# EAGLE design quahog-0.1.0 (EAGLE 7.6.0)
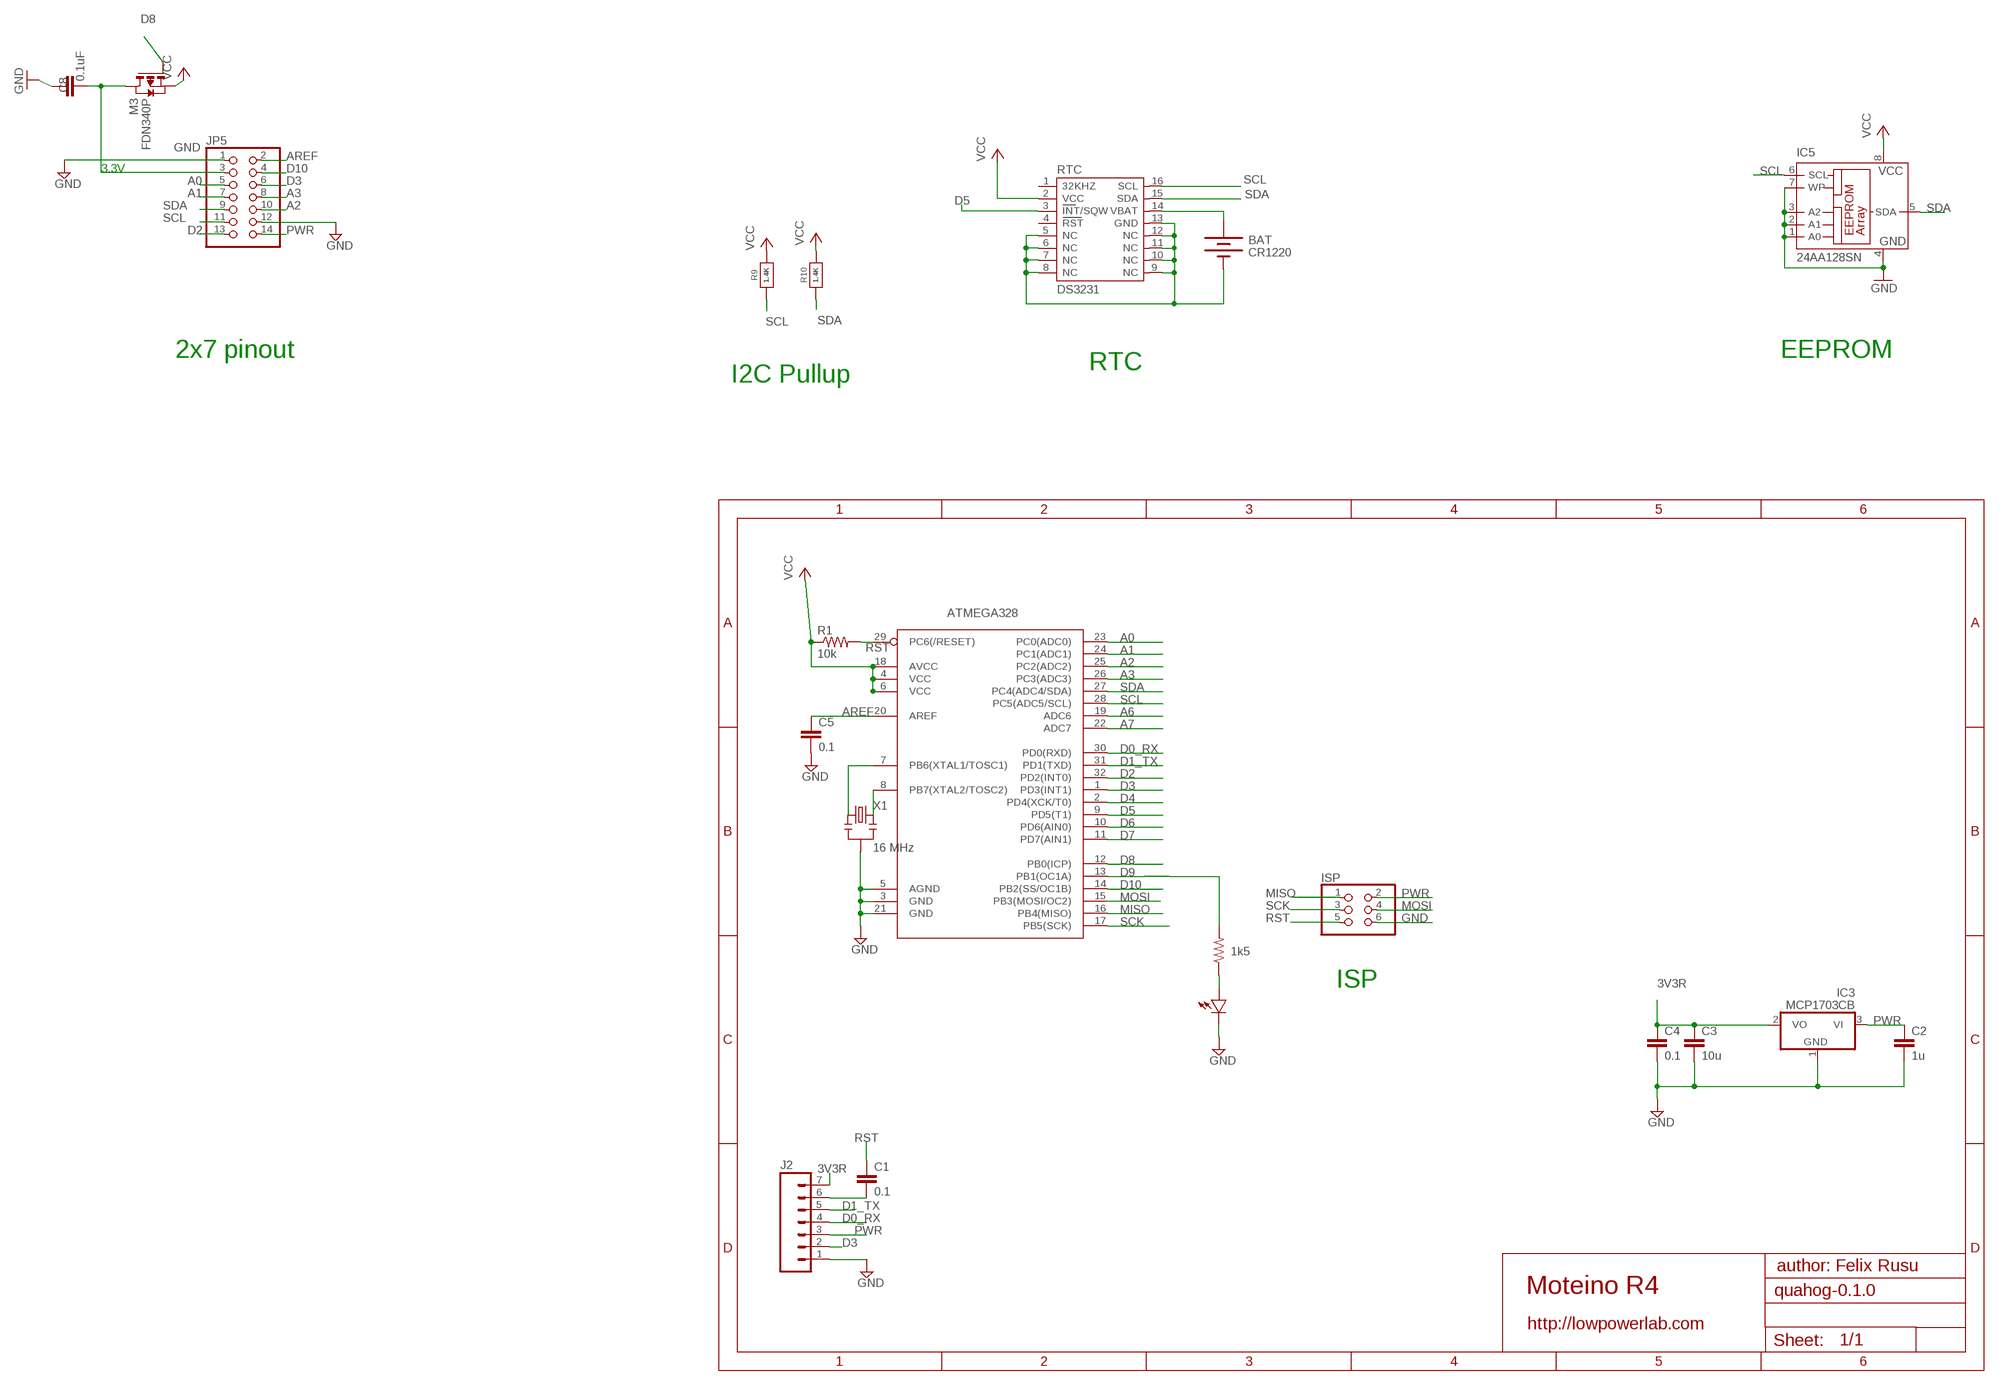
[diagram p0: schematic, sheet 1, part 1 of 2]
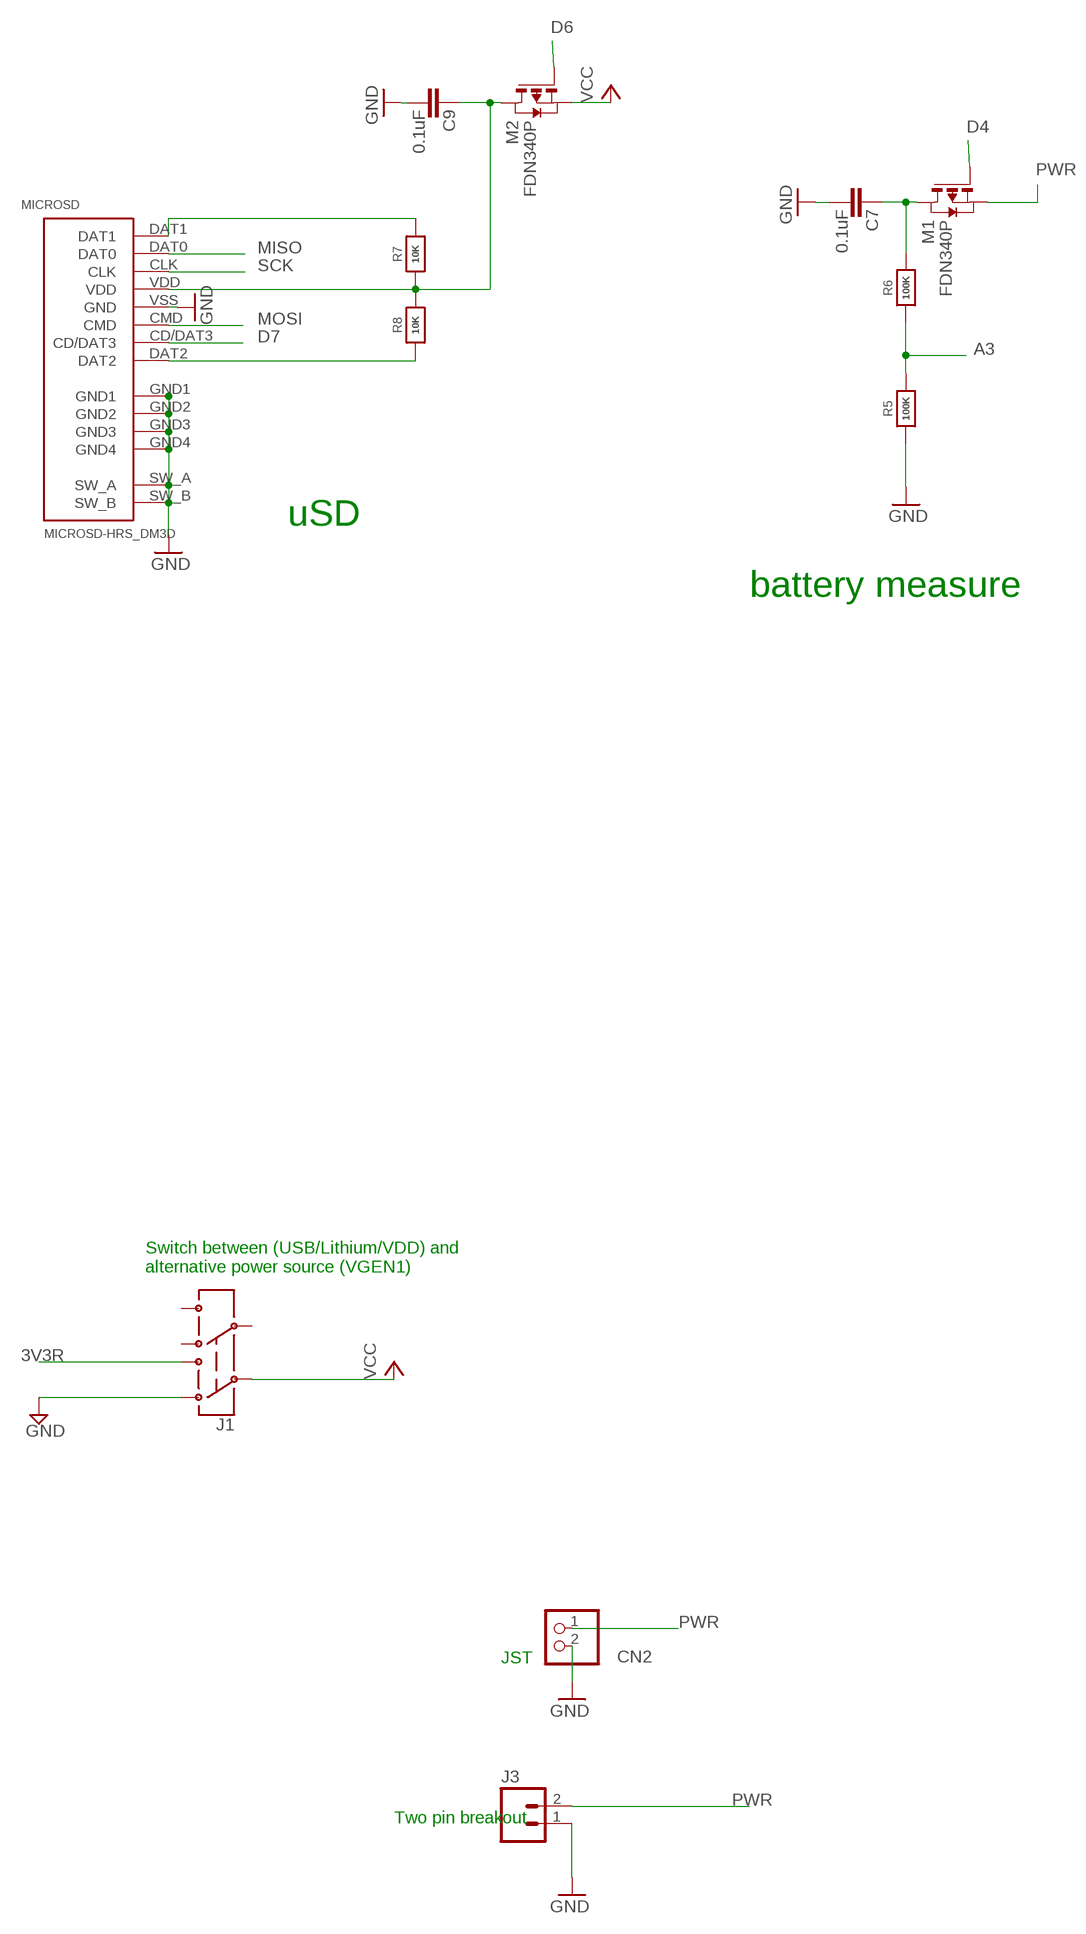
[diagram p1: schematic, sheet 1, part 2 of 2]

## Parts
ATMEGA328  ATMega-328  ATMEGA168/328TQFP32  [TQFP32-08]
BAT  CR1220  BATTERYBATTERY_12MM_SMT  [BATTCON_12MM_SMT]
C1  0.1  CAP0603-CAP  [0603-CAP]
C2  1u  CAP0603-CAP  [0603-CAP]
C3  10u  CAP0805-CAP  [0805-CAP]
C4  0.1  CAP0603-CAP  [0603-CAP]
C5  0.1  CAP0603-CAP  [0603-CAP]
C7  0.1uF  CAP0603-CAP  [0603-CAP]
C8  0.1uF  CAP0603-CAP  [0603-CAP]
C9  0.1uF  CAP0603-CAP  [0603-CAP]
CN2  JST_2PIN-SMT-RA  [JST-PH-2-SMT-RA]
D1  LED0603  [0603-LED]
IC3  MCP1703CB  [SOT23]
IC5  24AA128SN  [SO-08]
ISP  PINHD-2X3  [2X03]
J1  AYZ0202  [AYZ0202]
J2  M07  [1X07]
J3  M02PTH  [1X02]
JP5  PINHD-2X7  [2X07]
M1  FDN340P  PMOSSOT23  [SOT-23]
M2  FDN340P  PMOSSOT23  [SOT-23]
M3  FDN340P  PMOSSOT23  [SOT-23]
MICROSD  MICROSD-HRS_DM3D  [DM3D]
R1  10k  RESISTOR0603-RES  [0603-RES]
R2  1k5  RESISTOR0603-RES  [0603-RES]
R5  100K  RESISTOR_0603_NOOUT  [0603-NO]
R6  100K  RESISTOR_0603_NOOUT  [0603-NO]
R7  10K  RESISTOR_0603_NOOUT  [0603-NO]
R8  10K  RESISTOR_0603_NOOUT  [0603-NO]
R9  1.4K  RESISTOR_0603_NOOUT  [0603-NO]
R10  1.4K  RESISTOR_0603_NOOUT  [0603-NO]
RTC  DS3231  [DS3231]
X1  16 MHz  RESONATORSMD  [RESONATOR-SMD]

## Nets
3V3R: C3.1 C4.1 IC3.2(VO) J1.1 J2.7
A0: ATMEGA328.23(PC0(ADC0)) JP5.5
A1: ATMEGA328.24(PC1(ADC1)) JP5.7
A2: ATMEGA328.25(PC2(ADC2)) JP5.10
A3: ATMEGA328.26(PC3(ADC3)) JP5.8 R5.2 R6.1
A6: ATMEGA328.19(ADC6)
A7: ATMEGA328.22(ADC7)
AREF: ATMEGA328.20(AREF) C5.1 JP5.2
D0_RX: ATMEGA328.30(PD0(RXD)) J2.4
D1_TX: ATMEGA328.31(PD1(TXD)) J2.5
D2: ATMEGA328.32(PD2(INT0)) JP5.13
D3: ATMEGA328.1(PD3(INT1)) J2.2 JP5.6
D4: ATMEGA328.2(PD4(XCK/T0)) M1.3(G)
D5: ATMEGA328.9(PD5(T1)) RTC.3(INT/SQW)
D6: ATMEGA328.10(PD6(AIN0)) M2.3(G)
D7: ATMEGA328.11(PD7(AIN1)) MICROSD.CD/DAT3
D8: ATMEGA328.12(PB0(ICP)) M3.3(G)
D9: ATMEGA328.13(PB1(OC1A)) R2.2
D10: ATMEGA328.14(PB2(SS/OC1B)) JP5.4
GND [power]: ATMEGA328.3(GND) ATMEGA328.5(AGND) ATMEGA328.21(GND) BAT.P$1(-) C2.2 C3.2 C4.2 C5.2 C7.1 C8.2 C9.1 CN2.2 D1.MINUS IC3.1(GND) IC5.1(A0) IC5.2(A1) IC5.3(A2) IC5.4(GND) IC5.7(WP) ISP.6 J1.3 J2.1 J3.1 JP5.1 JP5.12 MICROSD.GND1 MICROSD.GND2 MICROSD.GND3 MICROSD.GND4 MICROSD.SW_A MICROSD.SW_B MICROSD.VSS(GND) R5.1 RTC.5(NC) RTC.6(NC) RTC.7(NC) RTC.8(NC) RTC.9(NC) RTC.10(NC) RTC.11(NC) RTC.12(NC) RTC.13(GND) X1.2
MISO: ATMEGA328.16(PB4(MISO)) ISP.1 MICROSD.DAT0
MOSI: ATMEGA328.15(PB3(MOSI/OC2)) ISP.4 MICROSD.CMD
N$1: ATMEGA328.7(PB6(XTAL1/TOSC1)) X1.1
N$2: D1.PLUS R2.1
N$4: C9.2 M2.1(D) MICROSD.VDD R7.1 R8.2
N$7: C8.1 JP5.3 M3.1(D)
N$15: C7.2 M1.1(D) R6.2
N$16: MICROSD.DAT1 R7.2
N$18: MICROSD.DAT2 R8.1
N$20: C1.2 J2.6
N$21: ATMEGA328.8(PB7(XTAL2/TOSC2)) X1.3
PWR [power]: C2.1 CN2.1 IC3.3(VI) ISP.2 J2.3 J3.2 JP5.14 M1.2(S)
RST: ATMEGA328.29(PC6(/RESET)) C1.1 ISP.5 R1.2
RTC_BATT: BAT.P$2(+) RTC.14(VBAT)
SCK: ATMEGA328.17(PB5(SCK)) ISP.3 MICROSD.CLK
SCL: ATMEGA328.28(PC5(ADC5/SCL)) IC5.6(SCL) JP5.11 R9.1 RTC.16(SCL)
SDA: ATMEGA328.27(PC4(ADC4/SDA)) IC5.5(SDA) JP5.9 R10.1 RTC.15(SDA)
VCC: ATMEGA328.4(VCC) ATMEGA328.6(VCC) ATMEGA328.18(AVCC) IC5.8(VCC) J1.2 M2.2(S) M3.2(S) R1.1 R9.2 R10.2 RTC.2(VCC)
Unconnected: J1.4 J1.5 J1.6 RTC.1(32KHZ) RTC.4(RST)

## Notes on the sheet
- 3.3V
- uSD
- 2x7 pinout | EEPROM
- RTC
- I2C Pullup
- battery measure
- Switch between (USB/Lithium/VDD) and 
  alternative power source (VGEN1)
- ISP
- JST
- Two pin breakout
- author: Felix Rusu
- Moteino R4
- http://lowpowerlab.com

## Library data of the parts
ATMEGA328 = LowPowerLab:ATMEGA168/328: Atmel 32-pin 8-bit micro, 16k flash.
BAT = SparkFunNew:BATTERY: Battery Holders Various common sizes : AA, AAA, 20mm coin cell and 12mm coin cell.
C1-C5 = LowPowerLab:CAP: Capacitor Standard 0603 ceramic capacitor, and 0.1" leaded capacitor.
C7-C9 = SparkFun:CAP: Capacitor Standard 0603 ceramic capacitor, and 0.1" leaded capacitor.
CN2 = adafruit:JST_2PIN: JST 2-Pin Connectors of various flavors SMT-RA (S2B-PH-SM4) 4UConnector #17311 SMT (B2B-PH-SM4) THM-RA (S2B-PH) THM (B2B-PH)
D1 = LowPowerLab:LED
IC3 = linear:MCP1703: 250 mA, 16V, Low Quiescent Current LDO Regulator Source: http://ww1.microchip.com/downloads/en/DeviceDoc/22049b.pdf
IC5 = microchip:24*: Serial EEPROM I2C; MF: MICROCHIP; MPN: 24AA128-I/SN; OC_FARNELL: unknown; OC_NEWARK: 92C6842
ISP = pinhead:PINHD-2X3: PIN HEADER
J1 = SparkFunNew:AYZ0202: SPDT Slide Switch Simple SMD single-pull double-throw slide switch. Good for less than 350mA power switch, switching UARTs between devices, etc. Spark Fun Electronics SKU : COM-00597
J2 = SparkFun-Connectors:M07: Header 7 Standard 7-pin 0.1" header. Use with straight break away headers (SKU : PRT-00116), right angle break away headers (PRT-00553), swiss pins (PRT-00743), machine pins (PRT-00117), and female headers (PRT-00115). NOTES ON THE VARIANTS LOCK and LOCK_LONGPADS... This footprint was designed to help hold the alignment of a through-hole component (i.e. 7-pin header) while soldering it into place. You may notice that each hole has been shifted either up or down by 0.005 of an inch from it's more standard position (which is usually a perfectly straight line). This slight alteration caused the pins (the squares in the middle) to touch the edges of the holes. Because they are alternating, it causes a "brace" to hold the header in place. 0.005 has proven to be the perfect amount of "off-center" position when using our standard breakaway headers. Although looks a little odd when you look at the bare footprint, once you have a header in there, the alteration is very hard to notice. Also, if you push a header all the way into place, it is covered up entirely on the bottom side. This idea of altering the position of holes to aid alignment will be further integrated into the Sparkfun Library for other footprints. It can help hold any component with 3 or more connection pins.
J3 = SparkFun-Connectors:M02: Standard 2-pin 0.1" header. Use with - straight break away headers ( PRT-00116) - right angle break away headers (PRT-00553) - swiss pins (PRT-00743) - machine pins (PRT-00117) - female headers (PRT-00115) Molex polarized connector foot print use with: PRT-08233 with associated crimp pins and housings. 2.54_SCREWTERM for use with PRT-10571. 3.5mm Screw Terminal footprints for PRT-08084 5mm Screw Terminal footprints for use with PRT-08432
JP5 = pinhead:PINHD-2X7: PIN HEADER
M1-M3 = zetex:PMOSSOT23: MOS FET; OC_FARNELL: unknown; OC_NEWARK: unknown
MICROSD = hrs_DM3D-SF:MICROSD-HRS_DM3D
R1 R2 = LowPowerLab:RESISTOR: Resistor Basic schematic elements and footprints for 0603, 1206, and PTH resistors.
R5-R10 = microbuilder:RESISTOR: Resistors For new designs, use the packages preceded by an '_' character since they are more reliable: The following footprints should be used on most boards: _0402 - Standard footprint for regular board layouts _0603 - Standard footprint for regular board layouts _0805 - Standard footprint for regular board layouts _1206 - Standard footprint for regular board layouts For extremely tight-pitch boards where space is at a premium, the following 'micro-pitch' footprints can be used (smaller pads, no silkscreen outline, etc.): _0402MP - Micro-pitch footprint for very dense/compact boards _0603MP - Micro-pitch footprint for very dense/compact boards _0805MP - Micro-pitch footprint for very dense/compact boards _1206MP - Micro-pitch footprint for very dense/compact boards
RTC = _lh-library:DS3231
X1 = SparkFun:RESONATOR: Resonator Small SMD resonator. This is the itty bitty 10/20MHz resonators with built in caps. CSTCE10M0G55 and CSTCE20M0V53. Footprint has been reviewed closely but hasn't been tested yet.

## Net classes
1 power: width 0.305 mm

## Board
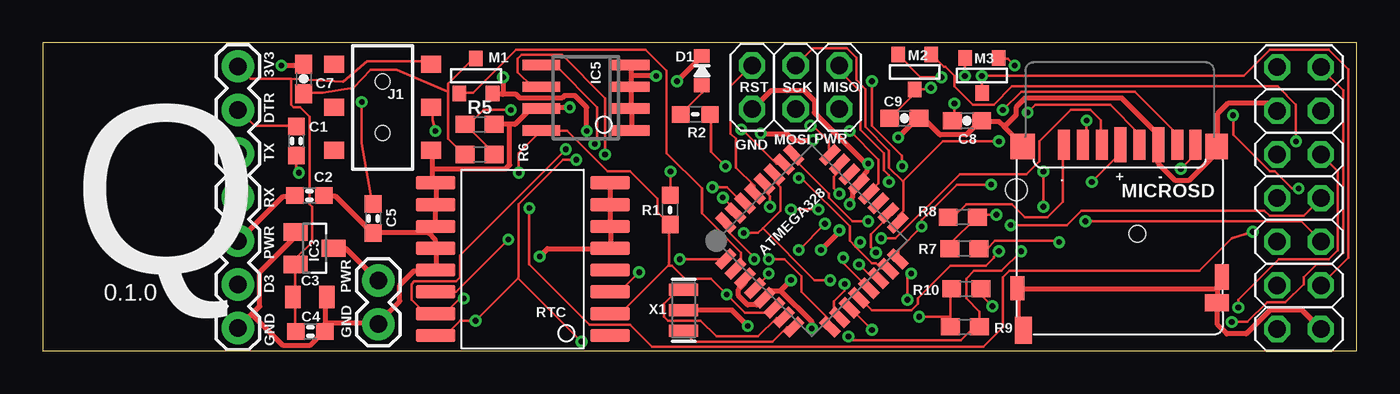
[diagram p2: board, top side]
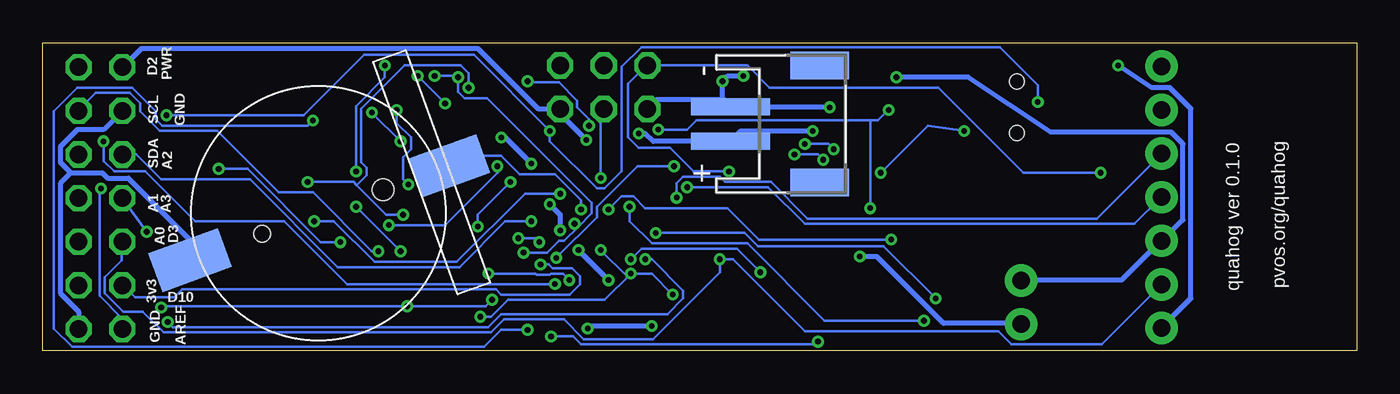
[diagram p3: board, bottom side, seen from below]

Size 76.5 x 17.92 mm. Coordinates in mm from the lower left corner, seen from the top.
Outline: 0,0 76.5,0 76.5,17.92 0,17.92 0,0
Copper layers (1*16): Top 0.0356mm / dielectric 1.5011mm / Bottom 0.0356mm
Design rules "oshpark-2layer *": minimum track width 6mil, minimum drill 13mil, track to track 6mil, track to pad 6mil, pad to pad 6mil, via to via 6mil, smd to smd 6mil, copper to edge 6mil, drill to drill 6mil, minimum pad ring 7mil, minimum via ring 7mil, stop-mask expansion 2.5mil, vias tented up to drill 0mil, thermal gap 10mil

### Footprints (pad centres in the part's own frame; a part is rotated, then mirrored left to right if it is on the bottom)
TQFP32-08 = smd 1.27 x 0.533: 1 -4.293,2.8; 2 -4.293,2; 3 -4.293,1.2; 4 -4.293,0.4; 5 -4.293,-0.4; 6 -4.293,-1.2; 7 -4.293,-2; 8 -4.293,-2.8; 17 4.293,-2.8; 18 4.293,-2; 19 4.293,-1.2; 20 4.293,-0.4; 21 4.293,0.4; 22 4.293,1.2; 23 4.293,2; 24 4.293,2.8 | smd 0.533 x 1.27: 9 -2.8,-4.293; 10 -2,-4.293; 11 -1.2,-4.293; 12 -0.4,-4.293; 13 0.4,-4.293; 14 1.2,-4.293; 15 2,-4.293; 16 2.8,-4.293; 25 2.8,4.293; 26 2,4.293; 27 1.2,4.293; 28 0.4,4.293; 29 -0.4,4.293; 30 -1.2,4.293; 31 -2,4.293; 32 -2.8,4.293
BATTCON_12MM_SMT = smd 2.4 x 4.3: P$1 0,11.96 | smd 2.4 x 4.2: P$2 0,-4.1 | hole 0.95: 0,7.5 | hole 1.25: 0,0
0603-CAP = smd 1.016 x 0.965: 1 -0.85,0; 2 0.85,0
0805-CAP = smd 0.902 x 1.3: 1 -1,0; 2 1,0
0603-CAP' = smd 1.1 x 1: 1 -0.85,0; 2 0.85,0
JST-PH-2-SMT-RA = smd 1 x 4.6: 1 1,-3.7; 2 -1,-3.7 | smd 1.6 x 3.4: NC1 -3.4,1.5; NC2 3.4,1.5
0603-LED = smd 0.8 x 0.9: MINUS -0.85,0; PLUS 0.85,0
SOT23 = smd 1 x 1.4: 1 -0.95,-1.1; 2 0.95,-1.1; 3 0,1.1
SO-08 = smd 0.6 x 2.2: 1 -1.905,-2.6; 2 -0.635,-2.6; 3 0.635,-2.6; 4 1.905,-2.6; 5 1.905,2.6; 6 0.635,2.6; 7 -0.635,2.6; 8 -1.905,2.6
2X03 = drill 1.016 octagon: 1 -2.54,-1.27; 2 -2.54,1.27; 3 0,-1.27; 4 0,1.27; 5 2.54,-1.27; 6 2.54,1.27
AYZ0202 = smd 1 x 1.15: 1 -2.5,2.825; 2 0,2.825; 3 2.5,2.825; 4 -2.5,-2.825; 5 0,-2.825; 6 2.5,-2.825 | hole 0.85: 1.5,0; -1.5,0
1X07 = drill 1.016 pad 1.88: 1 0,0; 2 2.54,0; 3 5.08,0; 4 7.62,0; 5 10.16,0; 6 12.7,0; 7 15.24,0
1X02 = drill 1.016 pad 1.88: 1 0,0; 2 2.54,0
2X07 = drill 1.016 octagon: 1 -7.62,-1.27; 2 -7.62,1.27; 3 -5.08,-1.27; 4 -5.08,1.27; 5 -2.54,-1.27; 6 -2.54,1.27; 7 0,-1.27; 8 0,1.27; 9 2.54,-1.27; 10 2.54,1.27; 11 5.08,-1.27; 12 5.08,1.27; 13 7.62,-1.27; 14 7.62,1.27
SOT-23 = smd 0.787 x 0.889: 1 0.025,-1.016; 2 -0.94,1.016; 3 0.991,1.016
DM3D = smd 0.7 x 1.75: CD/DAT3 8.15,0.45; CLK 4.85,0.45; CMD 7.05,0.45; DAT0 2.65,0.45; DAT1 1.6,0.45; DAT2 9.25,0.45 | smd 0.8 x 1.5: GND1 0.05,8.15 | smd 0.8 x 1.4: GND2 11.95,8.8 | smd 1.4 x 1.5: GND3 11.65,0.55 | smd 1.3 x 1.5: GND4 0.35,0.55 | smd 1 x 1.55: SW_A 11.6,11.25 | smd 1.4 x 1: SW_B 0.35,9.65 | smd 0.7 x 2.032: VDD 5.95,0.45; VSS 3.75,0.45
0603-RES = smd 1.016 x 0.965: 1 -0.85,0; 2 0.85,0
0603-NO = smd 1.1 x 1: 1 -0.85,0; 2 0.85,0
DS3231 = smd 0.762 x 2.286: 1 -4.445,-5.08; 2 -3.175,-5.08; 3 -1.905,-5.08; 4 -0.635,-5.08; 5 0.635,-5.08; 6 1.905,-5.08; 7 3.175,-5.08; 8 4.445,-5.08; 9 4.445,5.08; 10 3.175,5.08; 11 1.905,5.08; 12 0.635,5.08; 13 -0.635,5.08; 14 -1.905,5.08; 15 -3.175,5.08; 16 -4.445,5.08
RESONATOR-SMD = smd 0.7 x 1.7: 1 -1.2,0; 2 0,0; 3 1.2,0

### Placement (x,y rotation side)
ATMEGA328  44.78,6.4 45 top
BAT  56.69,9.37 110 bottom
C1  14.76,12.22 90 top
C2  15.52,9.04 0 top
C3  15.54,3.12 0 top
C4  15.57,1.12 0 top
C5  19.23,7.7 270 top
C7  0.1uF  [0603-CAP']  15.19,15.82 270 top
C8  0.1uF  [0603-CAP']  53.82,13.39 0 top
C9  0.1uF  [0603-CAP']  50.17,13.54 180 top
CN2  32.77,13.21 270 bottom
D1  38.38,16.31 270 top
IC3  15.82,5.97 270 top
IC5  31.62,14.73 90 top
ISP  43.84,15.34 180 top
J1  19.79,14.17 270 top
J2  11.35,1.32 90 top
J3  19.53,1.55 90 top
JP5  73.15,8.89 90 top
M1  25.25,16 180 top
M2  50.75,16.23 0 top
M3  54.66,16.03 0 top
MICROSD  68.71,12.45 180 top
R1  36.53,8.2 90 top
R2  38,13.77 0 top
R5  25.43,13.18 180 top
R6  25.43,11.43 180 top
R7  53.67,5.94 0 top
R8  53.57,7.77 0 top
R9  53.7,1.4 180 top
R10  53.77,3.61 180 top
RTC  27.94,5.33 90 top
X1  37.31,2.36 270 top

### Tracks (layer width: path | path; a pad name or v marks a point on that pad's centre or on a via)
3V3R
  Top 0.152: C4.1 14.68,1.14 14.68,3.05 14.6,3.12 C3.1 14.68,3.12 14.68,4.95 IC3.2 14.76,5.03 14.76,5.41 15.67,6.33 15.67,8.38 15.52,8.53 15.52,13.64 14.99,14.17 14.6,14.17 14.45,14.33 14.45,15.85 | 14.45,15.85 12.09,15.85 11.4,16.54 J2.7 | 14.45,15.85 17.47,15.67 18.87,16.87 22.33,16.87 J1.1
A0  (via drill 0.33)
  Top 0.152: v46.38,9.14 46.08,9.45 46.08,10.13 46.38,10.44 46.38,10.82 ATMEGA328.23 | v60.71,7.54 73.28,7.54 74.42,6.4 JP5.5
  Bottom 0.152: v46.38,9.14 48.44,9.14 52.4,5.18 57.2,5.18 59.56,7.54 v60.71,7.54
A1  (via drill 0.33)
  Top 0.152: v44.7,13.11 44.86,13.11 45.77,12.19 45.77,11.43 ATMEGA328.24 | v48.29,15.7 48.29,13.11 50.04,11.35 v50.04,10.74 | v56.36,7.32 59.64,7.32 60.48,8.15 71.14,8.15 71.45,7.85 73.43,7.85 74.42,8.84 JP5.7
  Bottom 0.152: v44.7,13.11 44.7,13.49 45.39,14.17 45.39,14.55 46.46,15.62 48.21,15.62 v48.29,15.7 | v50.04,10.74 50.04,10.36 53.09,7.32 v56.36,7.32
A2  (via drill 0.33)
  Top 0.152: v48.06,7.54 47.14,7.54 45.77,8.91 45.77,9.14 43.79,11.12 43.79,11.35 ATMEGA328.25
  Bottom 0.152: v48.06,7.54 49.58,7.54 52.25,4.88 59.33,4.88 64.44,9.98 69.62,9.98 71.07,11.43 JP5.10
A3  (via drill 0.33)
  Top 0.152: R6.1 26.34,11.43 R5.2 24.74,13.11 25.65,14.02 v27.25,14.02 | v40.67,12.88 40.74,12.88 42.72,10.9 43.1,10.9 ATMEGA328.26 | v70.46,6.93 69.24,6.55 67.33,4.65 56.29,4.65 55.91,4.27 55.91,1.37 54.76,0.23 35.48,0.23 34.19,1.52 31.83,1.52 28.32,5.03 v28.32,8.31
  Bottom 0.152: v40.67,12.88 38.99,12.88 38.46,13.41 28.32,13.41 | 28.32,13.41 27.86,13.41 v27.25,14.02 | v70.46,6.93 JP5.8 | 28.32,13.41 v28.32,8.31
AREF  (via drill 0.33)
  Top 0.152: v18.57,14.48 18.57,12.09 19.18,8.61 C5.1 | v46.99,12.8 48.67,11.12 48.67,9.75 48.13,9.22 ATMEGA328.20 | v73.13,9.45 72.75,9.45 71.75,10.44 71.45,10.44 69.32,12.57 v69.32,13.72
  Bottom 0.152: v18.57,14.48 18.57,15.47 20.78,17.68 41.66,17.68 42.8,16.54 42.8,10.44 43.79,9.45 44.25,9.45 46.99,12.19 v46.99,12.8 51.41,17.22 57.81,17.22 61.32,13.72 v69.32,13.72 | v73.13,9.45 73.2,9.37 73.2,3.2 71.91,1.91 71.91,1.29 JP5.2
D0_RX  (via drill 0.33)
  Top 0.152: v38.99,9.53 39.83,9.53 40.74,8.61 40.89,8.61 ATMEGA328.30
  Bottom 0.152: v38.99,9.53 34.27,9.53 32.13,7.39 12.93,7.39 11.4,8.91 J2.4
D1_TX  (via drill 0.33)
  Top 0.152: v39.6,8.91 40.28,8.23 40.28,8.08 ATMEGA328.31
  Bottom 0.152: v39.6,8.91 39.6,9.75 39.22,10.13 37.08,10.13 36.78,9.83 34.11,9.83 31.98,7.7 15.14,7.7 J2.5
D2  (via drill 0.33)
  Top 0.152: v41.43,5.33 41.43,5.41 39.83,7.01 39.83,7.39 ATMEGA328.32 | v69.24,1.68 70.16,1.68 71.3,2.82 72.36,2.82 73.43,3.89 73.43,4.27 74.19,5.03 75.03,5.03 75.72,5.71 75.72,15.16 74.42,16.46 JP5.13
  Bottom 0.152: v41.43,5.33 41.05,5.33 39.22,3.5 39.22,3.05 40.13,2.13 49.81,2.13 50.57,1.37 68.94,1.37 v69.24,1.68
D3  (via drill 0.33)
  Top 0.152: v37.08,5.33 39.75,5.33 ATMEGA328.1
  Bottom 0.152: J2.2 14.83,0.38 20.09,0.38 20.85,1.14 32.13,1.14 36.32,5.33 v37.08,5.33 37.08,4.57 40.97,0.69 45.01,0.69 46.15,1.83 49.66,1.83 50.42,1.07 69.47,1.07 70.69,2.29 71.83,2.29 72.9,3.35 72.9,4.27 71.91,5.26 71.91,6.33 JP5.6
D4
  Top 0.152: M1.3 24.28,15.01 25.04,15.01 27.56,17.53 35.1,17.53 36.32,16.31 36.32,11.51 38.38,9.45 38.38,8 40.67,5.71 40.67,5.11 40.36,4.8 ATMEGA328.2
D5  (via drill 0.33)
  Top 0.152: v42.27,5.33 43.18,5.33 44.17,4.34 44.17,3.43 45.77,1.83 45.77,1.45 ATMEGA328.9 | v34.72,4.57 33.58,3.43 RTC.3
  Bottom 0.152: v42.27,5.33 41.66,5.94 36.09,5.94 v34.72,4.57
D6  (via drill 0.33)
  Top 0.152: v72.97,12.19 72.97,14.33 71.91,15.39 56.44,15.39 55.37,14.33 54.15,14.33 53.09,15.39 53.09,16 52.55,16.54 52.48,16.54 51.79,17.22 M2.3 | v46.69,3.89 46.69,3.5 46.08,2.9 46.08,2.29 46.38,1.98 ATMEGA328.10
  Bottom 0.152: v72.97,12.19 72.97,11.05 72.36,10.44 70.54,10.44 67.64,7.54 62.46,7.54 58.8,3.89 v46.69,3.89
D7  (via drill 0.33)
  Top 0.152: v48.29,1.22 46.99,2.52 ATMEGA328.11 | v60.78,13.41 60.78,12.19 60.63,12.04 MICROSD.CD/DAT3
  Bottom 0.152: v48.29,1.22 49.81,1.22 50.8,0.23 74.8,0.23 75.87,1.29 75.87,13.95 74.5,15.32 71.3,15.32 69.93,13.95 69.93,13.49 69.55,13.11 61.09,13.11 v60.78,13.41
D8  (via drill 0.33)
  Top 0.152: v56.59,16.61 56.21,16.99 55.68,16.99 M3.3 | v58.27,8.38 v58.27,10.44 | v55.68,5.79 55.37,5.49 55.37,5.41 54.92,4.95 52.86,4.95 50.95,3.05 50.95,2.74 50.57,2.36 48.29,2.36 47.6,3.05 ATMEGA328.12
  Bottom 0.152: v56.59,16.61 56.59,15.93 58.27,14.25 v58.27,10.44 | v55.68,5.79 v58.27,8.38
D9  (via drill 0.33)
  Top 0.152: v39.75,10.74 38.91,11.58 38.91,13.72 R2.2 | v46.61,5.41 46.61,5.11 48.06,3.66 ATMEGA328.13
  Bottom 0.152: v39.75,10.74 41.89,10.74 44.25,8.38 44.25,7.77 v46.61,5.41
D10  (via drill 0.33)
  Top 0.152: v47.52,5.03 48.29,4.27 48.59,4.27 ATMEGA328.14
  Bottom 0.152: v47.52,5.03 47.07,5.03 46.84,4.8 45.7,4.8 45.24,4.34 45.24,3.89 45.85,3.28 49.81,3.28 50.11,3.58 68.4,3.58 68.86,3.12 71.14,3.12 71.83,3.81 JP5.4
GND  (via drill 0.33)
  Top 0.305: MICROSD.SW_A 57.05,1.22 56.82,1.45 56.82,3.58 MICROSD.GND2 56.97,3.58 68.33,3.58 MICROSD.GND1 68.63,4.27 68.4,4.04 68.4,2.82 MICROSD.SW_B 68.4,2.67 68.4,1.52 68.94,0.99 70.08,0.99 71.45,2.36 73.35,2.36 74.42,1.29 JP5.1 | 55.98,13.03 57.05,11.96 MICROSD.GND3 | 55.98,13.03 55.68,13.34 54.69,13.34 C8.2 54.53,13.34 53.77,12.57 52.25,12.57 51.33,13.49 51.03,13.49 C9.1 50.88,13.49 v49.81,12.42 | JP5.12 71.45,14.4 69.01,14.4 68.4,13.79 68.4,11.96 MICROSD.GND4 68.33,11.73 68.33,11.51 66.73,9.91 65.96,9.91 64.97,10.9 64.97,11.96 MICROSD.VSS 64.9,12.12 64.9,12.65 62.84,14.71 57.2,14.71 56.67,14.17 56.67,13.72 55.98,13.03 | IC5.1 34.27,12.88 34.27,14.1 IC5.2 34.27,14.17 34.27,15.32 IC5.3 34.27,15.47 34.27,16 | 34.27,16 34.27,16.61 IC5.4 | v36.93,15.7 38.38,17.14 D1.MINUS | v35.71,16 34.27,16 | ATMEGA328.3 40.89,4.19 40.89,3.96 40.51,3.58 40.51,3.2 41.05,2.67 41.58,2.67 41.96,3.05 ATMEGA328.5 42.11,3.2 42.42,3.5 42.95,3.5 | X1.2 40.13,2.36 v41.05,1.45 | v44.78,1.29 44.78,1.68 42.95,3.5 | 47.98,10.82 47.98,10.44 47.6,10.06 47.6,9.75 ATMEGA328.21 47.45,9.6 47.14,9.3 47.14,8.91 46.99,8.76 v46.99,8.53 | 47.98,10.82 44.93,13.87 44.93,14.55 44.32,15.16 42.42,15.16 41.35,14.1 ISP.6 | v43.56,4.12 42.95,3.5 | v45.31,5.87 46.38,6.93 v46.38,7.01 | 22.45,6.86 19.25,6.86 C5.2 19.1,6.93 17.04,8.99 16.43,8.99 C2.2 | 22.45,6.86 22.84,7.24 RTC.11 22.84,7.32 22.84,8.38 RTC.10 22.91,8.53 22.91,9.68 RTC.9 22.84,9.83 22.68,9.98 22.68,10.59 | 22.45,6.86 22.84,6.48 22.84,6.1 RTC.12 22.91,5.94 22.91,4.72 RTC.13 22.76,4.65 21.61,4.65 20.78,3.81 20.78,2.9 19.56,1.68 J3.1 19.48,1.6 16.43,1.6
  Top 0.305: 27.18,13.18 27.48,13.18 28.4,14.1 IC5.7 29.16,14.17 v30.68,14.17 | 27.18,13.18 R5.1 | 22.68,10.59 22.68,11.73 J1.3 | 27.18,13.18 27.18,10.82 26.95,10.59 22.68,10.59 | v13.89,16.61 15.14,16.61 C7.1 | J2.1 12.17,2.13 | 12.17,2.13 12.62,2.59 12.62,4.57 14.68,6.63 14.68,6.86 IC3.1 | RTC.8 33.05,9.75 33.05,8.61 RTC.7 33.05,8.46 33.05,7.32 RTC.6 33.05,7.24 33.05,6.02 RTC.5 32.89,5.94 29.39,5.94 v28.93,5.49 | 16.43,1.6 16.43,3.05 16.51,3.12 C3.2 | 16.43,1.6 16.43,1.14 C4.2 16.28,1.07 15.52,0.3 13.99,0.3 12.17,2.13 | v48.06,10.9 47.98,10.82
  Bottom 0.305: 74.88,10.36 73.05,10.36 72.75,10.06 71.53,10.06 67.94,6.48 67.94,5.33 BAT.P$1 | 74.88,10.36 75.49,10.97 75.49,11.89 74.5,12.88 72.97,12.88 JP5.12 | JP5.1 74.42,2.29 75.49,3.35 75.49,9.75 74.88,10.36 | CN2.2 36.47,14.25 36.93,14.71 v36.93,15.7 36.63,16 v35.71,16 | v41.05,1.45 44.63,1.45 v44.78,1.29 | v45.31,5.87 v43.56,4.12 | v46.38,7.01 46.38,7.92 v46.99,8.53 | ISP.6 40.74,14.63 37.01,14.63 CN2.2 | v13.89,16.61 11.94,15.32 10.87,15.32 9.65,14.1 9.65,3.05 11.33,1.37 J2.1 | v28.93,5.49 27.94,5.49 24.05,1.6 19.56,1.6 J3.1 | v30.68,14.17 36.32,14.17 CN2.2 | v49.81,12.42 49.58,12.42 v48.06,10.9
MISO  (via drill 0.33)
  Top 0.152: v49.28,9.83 49.28,10.21 48.97,10.52 48.97,11.51 47.6,12.88 47.6,15.09 46.38,16.31 ISP.1 | ATMEGA328.16 49.81,5.41 49.81,5.87 v51.18,7.24 51.18,7.62 53.24,9.68 v55.22,9.68 | v55.91,14.02 56.97,15.09 63.6,15.09 66.04,12.65 66.04,12.04 MICROSD.DAT0
  Bottom 0.152: v51.18,7.24 51.18,7.92 v49.28,9.83 | v55.91,14.02 55.91,13.26 55.07,12.42 55.07,11.73 55.52,11.28 55.52,9.98 v55.22,9.68
MOSI  (via drill 0.33)
  Top 0.152: 47.33,6.06 46.99,6.4 46.99,7.24 44.17,10.06 v44.02,10.06 | 47.33,6.06 48.29,5.11 48.51,5.11 48.82,4.8 49.2,4.8 ATMEGA328.15 | v48.82,6.55 49.66,6.55 53.39,10.29 57.28,10.29 58.04,11.05 58.04,12.19 59.87,14.02 61.01,14.02 61.62,13.41 61.62,12.04 MICROSD.CMD | 47.33,6.06 v47.6,6.33
  Bottom 0.152: v44.02,10.06 44.02,13.87 43.87,14.02 ISP.4 | v48.82,6.55 47.83,6.55 v47.6,6.33
N$1
  Top 0.152: ATMEGA328.7 43.1,1.91 42.72,1.91 41.66,0.84 39.22,0.84 38.3,1.75 36.4,1.75 36.17,1.98 36.17,2.74 36.93,3.5 37.31,3.5 X1.1
N$2
  Top 0.152: D1.PLUS 38.38,15.01 37.16,13.79 R2.1
N$4  (via drill 0.33)
  Top 0.152: C9.2 49.35,13.56 50.72,14.94 50.72,15.16 M2.1 50.8,15.24 51.64,15.24 v51.71,15.32 | R7.1 52.86,5.94 52.86,6.25 54.38,7.77 R8.2 54.46,7.77 54.61,7.92 v55.52,7.92 | v61.09,9.83 62.69,11.43 62.69,11.96 MICROSD.VDD
  Bottom 0.152: v61.09,9.83 58.42,9.83 58.23,9.64 | 58.23,9.64 56.52,7.92 v55.52,7.92 | v51.71,15.32 51.71,16.15 52.17,16.61 55.45,16.61 57.96,14.1 57.96,10.97 57.66,10.67 57.66,10.21 58.23,9.64
N$7  (via drill 0.33)
  Top 0.152: M3.1 v54.69,16 69.93,16 71.45,17.53 74.88,17.53 76.02,16.38 76.02,5.41 JP5.3 | v53.09,14.4 53.09,13.49 53.01,13.41 C8.1
  Bottom 0.152: v53.09,14.4 v54.69,16
N$15
  Top 0.152: 23.6,15.09 23.6,12.34 24.51,11.43 R6.2 | 23.6,15.09 23.6,15.54 25.04,16.99 25.2,16.99 M1.1 | 23.6,15.09 20.6,16.36 19.07,16.36 18.09,15.32 16.28,15.01 15.21,15.01 C7.2
N$16  (via drill 0.33)
  Top 0.152: R7.2 54.99,5.94 55.45,6.4 59.11,6.4 v59.18,6.33 | v66.27,10.59 67.11,11.43 67.11,11.96 MICROSD.DAT1
  Bottom 0.152: v59.18,6.33 60.33,6.33 64.59,10.59 v66.27,10.59
N$18
  Top 0.152: R8.1 53.01,7.77 53.77,8.53 56.44,8.53 57.2,7.77 58.5,7.77 59.41,8.69 59.41,11.96 MICROSD.DAT2
N$20
  Top 0.152: C1.2 14.76,13.11 12.32,13.11 11.4,14.02 J2.6
N$21
  Top 0.152: ATMEGA328.8 43.71,1.37 43.33,1.37 42.49,0.53 37.92,0.53 37.31,1.14 X1.3
PWR  (via drill 0.33)
  Top 0.305: 26.8,14.94 27.56,14.94 27.79,14.71 30.23,14.71 30.38,14.86 30.99,14.86 31.67,14.17 v31.67,12.8 | 26.8,14.94 26.19,14.94 M1.2 | IC3.3 16.97,5.94 17.65,5.94 19.48,4.12 J3.2 | C2.1 14.6,8.99 13.99,8.99 11.4,6.4 J2.3 | v26.8,15.93 26.8,14.94 | v44.86,12.27 43.71,12.27 43.33,12.65 v41.81,12.65
  Bottom 0.305: JP5.14 71.83,16.54 70.76,17.6 51.18,17.6 47.68,14.1 46.38,14.1 ISP.2 46.3,13.95 46.3,13.72 v44.86,12.27 | v31.67,12.8 35.87,12.8 36.4,12.27 CN2.1 36.55,12.19 40.97,12.19 41.43,12.65 v41.81,12.65 | J3.2 19.48,4.12 13.69,4.12 11.4,6.4 J2.3 11.25,6.48 10.11,7.62 10.11,12.04 10.79,12.72 17.8,12.72 22.63,15.93 v26.8,15.93
RST  (via drill 0.33)
  Top 0.152: v36.55,10.44 36.55,9.07 R1.2 | C1.1 14.76,10.52 v14.91,10.36 | ATMEGA328.29 41.43,9.22 41.43,9.6 40.36,10.67 40.36,12.34 40.06,12.65 40.06,15.39 41.28,16.61 ISP.5
  Bottom 0.152: v36.55,10.44 38.61,10.44 39.98,11.81 41.81,11.81 42.42,12.42 42.42,15.54 41.35,16.61 ISP.5 35.48,16.61 34.19,15.32 24.36,15.32 19.41,10.36 v14.91,10.36
RTC_BATT  (via drill 0.33)
  Top 0.152: RTC.14 24.05,3.43 v27.1,6.48 | v45.16,8.23 v43.56,8.23
  Bottom 0.152: v27.1,6.48 34.8,6.48 36.63,8.31 41.43,8.31 42.11,8.99 42.8,8.99 v43.56,8.23 | v45.16,8.23 45.16,8.76 46.69,10.29 48.74,10.29 49.81,11.35 52.25,11.35 52.78,10.82 BAT.P$2
SCK  (via drill 0.33)
  Top 0.152: 50.08,9.87 49.28,10.67 49.28,11.66 47.9,13.03 47.9,15.24 47.37,15.77 47.37,17.07 46.84,17.6 44.86,17.6 43.87,16.61 ISP.3 | 50.08,9.87 50.11,9.83 50.11,8.15 49.81,7.85 ATMEGA328.17 | v57.35,13.87 57.81,14.33 62.15,14.33 63.83,12.65 63.83,12.04 MICROSD.CLK | v55.68,12.19 52.4,12.19 50.08,9.87
  Bottom 0.152: v55.68,12.19 v57.35,13.87
SCL  (via drill 0.33)
  Top 0.152: v56.97,5.79 55.83,4.65 54.23,4.65 53.77,4.19 53.77,3.05 54.53,2.29 54.53,1.45 R9.1 54.46,1.45 54.3,1.45 53.47,0.61 47.14,0.61 v46.91,0.84 | v42.34,8.38 42.34,8.99 42.04,9.3 42.04,9.68 ATMEGA328.28 | RTC.16 22.91,0.91 23.44,0.91 24.28,1.75 v25.2,1.75 27.67,4.23 | v32.74,11.43 32.74,14.71 30.23,17.22 27.86,17.22 27.63,16.99 27.63,16.23 28.47,15.39 29.01,15.39 IC5.6 | v31.06,11.12 30.3,11.12 27.71,8.53 27.71,4.27 27.67,4.23 | 27.67,4.23 v31.37,0.53
  Bottom 0.152: v56.97,5.79 57.35,5.79 60.78,9.22 62.76,9.22 66.34,12.8 69.7,12.8 70.84,13.95 70.84,14.4 71.45,15.01 73.43,15.01 74.42,14.02 JP5.11 | v42.34,8.38 42.34,7.54 41.05,6.25 35.48,6.25 30.99,1.75 v25.2,1.75 | v32.74,11.43 31.37,11.43 v31.06,11.12 | v46.91,0.84 45.62,0.84 45.16,0.38 31.52,0.38 v31.37,0.53
SDA  (via drill 0.33)
  Top 0.152: v55.3,2.59 54.69,3.2 54.69,3.58 R10.1 | v69.62,2.52 69.62,2.97 71.98,5.33 74.88,5.33 75.41,5.87 75.41,10.44 JP5.9 | 41.92,7.12 41.66,6.86 v40.82,6.86 | 41.92,7.12 42.95,8.15 42.95,9.53 42.65,9.83 42.65,10.21 ATMEGA328.27 | v24.51,3.05 24.28,3.05 23.44,2.21 22.91,2.21 RTC.15 22.84,2.21 22.22,2.21 21.46,2.97 21.46,3.89 21.61,4.04 24.05,4.04 24.28,4.27 24.28,5.56 v30.45,11.73 | v32.13,12.04 32.28,12.19 32.28,14.17 29.84,16.61 29.08,16.61 IC5.5 | v50.34,2.97 50.34,4.27 v50.57,4.5 | v45.85,4.12 44.93,4.12 41.92,7.12
  Bottom 0.152: v69.62,2.52 69.55,2.59 v55.3,2.59 50.72,2.59 v50.34,2.97 | v40.82,6.86 35.64,6.86 34.87,6.1 27.56,6.1 v24.51,3.05 | v32.13,12.04 30.76,12.04 v30.45,11.73 | v50.57,4.5 47.83,4.5 47.75,4.42 46.99,4.42 46.91,4.5 46.23,4.5 v45.85,4.12
VCC  (via drill 0.33)
  Top 0.152: v53.7,16 53.7,16.99 M3.2 | v52.32,15.93 51.11,15.93 49.81,17.22 M2.2 | v48.51,5.71 48.21,6.02 48.21,6.78 49.2,7.77 49.2,8 ATMEGA328.18 | v22.86,12.8 22.68,13.41 22.68,14.25 J1.2 | v27.71,10.36 27.71,11.51 29.01,12.8 IC5.8 29.08,12.8 30.53,12.8 32.89,10.44 34.19,10.44 35.79,8.84 35.79,8.08 36.47,7.39 R1.1 36.47,7.32 36.47,5.03 36.44,4.99 | 36.44,4.99 33.66,2.21 33.05,2.21 RTC.2 | 52.86,1.98 52.86,3.58 R10.2 | 52.86,1.98 52.86,1.45 R9.2 | v42.27,4.5 42.27,4.42 41.5,3.66 ATMEGA328.4 | ATMEGA328.6 42.57,2.52 42.27,2.21 40.89,2.21 v39.83,3.28 38.91,4.19 37.39,4.19 36.63,4.95 36.47,4.95 36.44,4.99 | v51.03,1.98 52.86,1.98 | v44.02,5.87 v45.54,7.39
  Bottom 0.152: v53.7,16 52.4,16 v52.32,15.93 52.32,15.09 51.94,14.71 50.65,14.71 44.55,8.61 44.55,8 45.35,7.2 | v48.51,5.71 47.14,5.71 46.46,6.4 46.15,6.4 45.35,7.2 | v22.86,12.8 24.97,13.11 v27.71,10.36 | v42.27,4.5 41.05,4.5 v39.83,3.28 | v51.03,1.98 50.42,1.98 49.43,2.97 43.79,2.97 v42.27,4.5 | v45.54,7.39 45.35,7.2 | v44.02,5.87 42.49,4.34 v42.27,4.5

### Text on the board
tPlace: 3V3 | MISO | RST | SCK | DTR | PWR | TX | GND | MOSI | RX | PWR | Q | D3 | 0.1.0 | PWR | GND | GND
bPlace: PWR | D2 | GND | SCL | A2 | SDA | A3 | A1 | D3 | A0 | pvos.org/quahog | quahog ver 0.1.0 | AREF | D10 | 3v3 | GND